# Altium schematic sheet stm32f107rct7_devbrd.SchDoc
size A4
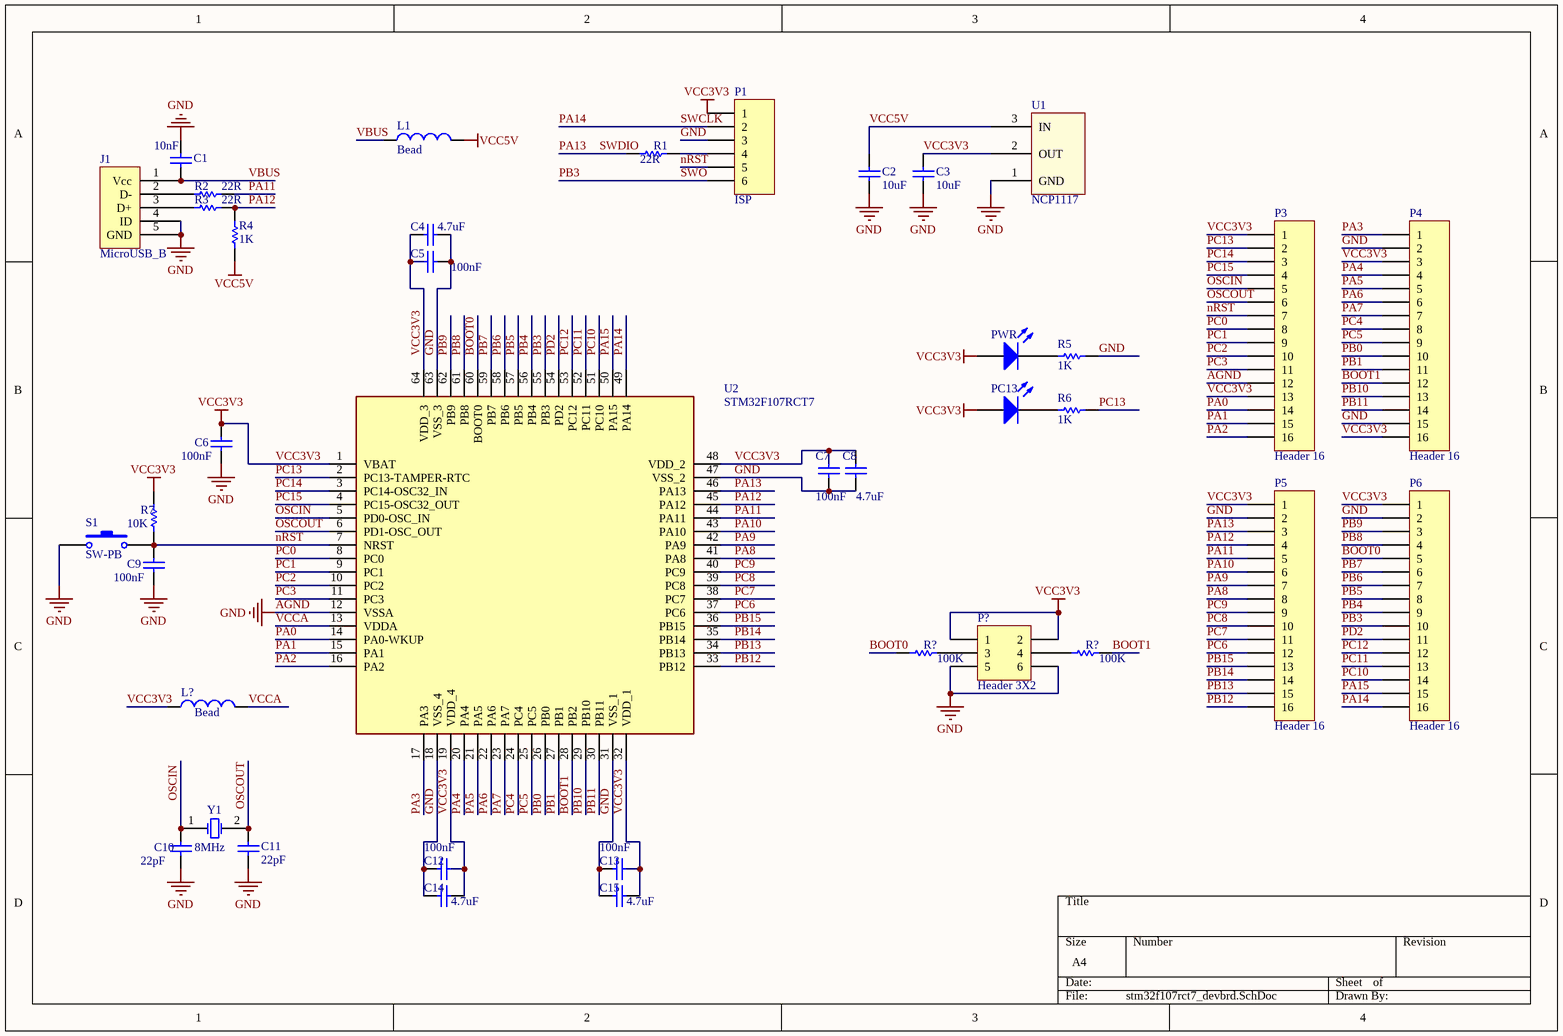
[diagram p0: stm32f107rct7_devbrd.SchDoc]

## Parts
(Parts that share a designator on the sheet are numbered #1, #2 ... from top to bottom, then left to right.)
C1  value 10nF  [SMD0805_CAP]  (hidden comment: Cap Semi)
C2  value 10uF  [SMD0805_CAP]  (hidden comment: Cap Semi)
C3  value 10uF  [SMD0805_CAP]  (hidden comment: Cap Semi)
C4  value 4.7uF  [SMD0805_CAP]  (hidden comment: Cap Semi)
C5  value 100nF  [SMD0805_CAP]  (hidden comment: Cap Semi)
C6  value 100nF  [SMD0805_CAP]  (hidden comment: Cap Semi)
C7  value 100nF  [SMD0805_CAP]  (hidden comment: Cap Semi)
C8  value 4.7uF  [SMD0805_CAP]  (hidden comment: Cap Semi)
C9  value 100nF  [SMD0805_CAP]  (hidden comment: Cap Semi)
C10  value 22pF  [SMD0805_CAP]  (hidden comment: Cap Semi)
C11  value 22pF  [SMD0805_CAP]  (hidden comment: Cap Semi)
C12  value 100nF  [SMD0805_CAP]  (hidden comment: Cap Semi)
C13  value 100nF  [SMD0805_CAP]  (hidden comment: Cap Semi)
C14  value 4.7uF  [SMD0805_CAP]  (hidden comment: Cap Semi)
C15  value 4.7uF  [SMD0805_CAP]  (hidden comment: Cap Semi)
J1  MicroUSB_B  [micro_usb_molex_105017-0001]
L1  Bead  [SMD0805]
L?  Bead  [SMD0805]
P1  ISP  [ISP]
P3  Header 16  [HDR1X16]
P4  Header 16  [HDR1X16]
P5  Header 16  [HDR1X16]
P6  Header 16  [HDR1X16]
P?  Header 3X2  [HDR2X3]
PC13  LED0  [LED]  (value not drawn)
PWR  LED0  [LED]  (value not drawn)
R1  value 22R  [SMD0805]  (hidden comment: Res Semi)
R2  value 22R  [SMD0805]  (hidden comment: Res Semi)
R3  value 22R  [SMD0805]  (hidden comment: Res Semi)
R4  value 1K  [SMD0805]  (hidden comment: Res Semi)
R5  value 1K  [SMD0805]  (hidden comment: Res Semi)
R6  value 1K  [SMD0805]  (hidden comment: Res Semi)
R7  value 10K  [SMD0805]  (hidden comment: Res Semi)
R?#1  value 100K  [SMD0805]  (hidden comment: Res Semi)
R?#2  value 100K  [SMD0805]  (hidden comment: Res Semi)
S1  SW-PB  [button_small]
U1  NCP1117  [SOT-223-2]
U2  STM32F107RCT7  [QFP50P1200X1200X160-64N]
Y1  8MHz  [XTAL]

## Nets
AGND: C1.2 C2.1 C3.1 C4.1 C5.1 C6.1 C7.1 C8.1 C9.1 C10.2 C11.2 C12.1 C13.1 C14.1 C15.1 J1.4(ID) J1.5(GND) P1.3 P3.12 P4.2 P4.15 P5.2 P6.2 P?.5 P?.6 R5.1 S1.1 U1.1(GND) U2.12(VSSA) U2.18(VSS_4) U2.31(VSS_1) U2.47(VSS_2) U2.63(VSS_3)  [also labelled GND]
VCC3V3: C3.2 C4.2 C5.2 C6.2 C7.2 C8.2 C12.2 C13.2 C14.2 C15.2 L?.1 P1.1 P3.1 P3.13 P4.3 P4.16 P5.1 P6.1 P?.1 P?.2 PC13.1(A) PWR.1(A) R7.2 U1.2(OUT) U2.1(VBAT) U2.19(VDD_4) U2.32(VDD_1) U2.48(VDD_2) U2.64(VDD_3)
VCC5V: C2.2 L1.2 R4.1 U1.3(IN)
BOOT0: P6.5 R?#1.1 U2.60(BOOT0)
BOOT1: P4.12 R?#2.2 U2.28(PB2)
nRST: C9.2 P1.5 P3.7 R7.1 S1.2 U2.7(NRST)
OSCIN: C10.1 P3.5 U2.5(PD0-OSC_IN) Y1.1(OSC1)
OSCOUT: C11.1 P3.6 U2.6(PD1-OSC_OUT) Y1.2(OSC2)
PA0: P3.14 U2.14(PA0-WKUP)
PA1: P3.15 U2.15(PA1)
PA2: P3.16 U2.16(PA2)
PA3: P4.1 U2.17(PA3)
PA4: P4.4 U2.20(PA4)
PA5: P4.5 U2.21(PA5)
PA6: P4.6 U2.22(PA6)
PA7: P4.7 U2.23(PA7)
PA8: P5.8 U2.41(PA8)
PA9: P5.7 U2.42(PA9)
PA10: P5.6 U2.43(PA10)
PA11: P5.5 R2.2 U2.44(PA11)
PA12: P5.4 R3.2 R4.2 U2.45(PA12)
PA13: P5.3 R1.1 U2.46(PA13)  [also labelled SWDIO]
PA14: P1.2 P6.16 U2.49(PA14)  [also labelled SWCLK]
PA15: P6.15 U2.50(PA15)
PB0: P4.10 U2.26(PB0)
PB1: P4.11 U2.27(PB1)
PB3: P1.6 P6.10 U2.55(PB3)  [also labelled SWO]
PB4: P6.9 U2.56(PB4)
PB5: P6.8 U2.57(PB5)
PB6: P6.7 U2.58(PB6)
PB7: P6.6 U2.59(PB7)
PB8: P6.4 U2.61(PB8)
PB9: P6.3 U2.62(PB9)
PB10: P4.13 U2.29(PB10)
PB11: P4.14 U2.30(PB11)
PB12: P5.16 U2.33(PB12)
PB13: P5.15 U2.34(PB13)
PB14: P5.14 U2.35(PB14)
PB15: P5.13 U2.36(PB15)
PC0: P3.8 U2.8(PC0)
PC1: P3.9 U2.9(PC1)
PC2: P3.10 U2.10(PC2)
PC3: P3.11 U2.11(PC3)
PC4: P4.8 U2.24(PC4)
PC5: P4.9 U2.25(PC5)
PC6: P5.12 U2.37(PC6)
PC7: P5.11 U2.38(PC7)
PC8: P5.10 U2.39(PC8)
PC9: P5.9 U2.40(PC9)
PC10: P6.14 U2.51(PC10)
PC11: P6.13 U2.52(PC11)
PC12: P6.12 U2.53(PC12)
PC13: P3.2 R6.1 U2.2(PC13-TAMPER-RTC)
PC14: P3.3 U2.3(PC14-OSC32_IN)
PC15: P3.4 U2.4(PC15-OSC32_OUT)
PD2: P6.11 U2.54(PD2)
VBUS: C1.1 J1.1(Vcc) L1.1
VCCA: L?.2 U2.13(VDDA)
NetJ1_2: J1.2(D-) R2.1
NetJ1_3: J1.3(D+) R3.1
NetP1_4: P1.4 R1.2
NetP?_3: P?.3 R?#1.2
NetP?_4: P?.4 R?#2.1
NetPC13_2: PC13.2(K) R6.2
NetPWR_2: PWR.2(K) R5.2

## Library data of the parts
C1-C15 = Cap Semi: Capacitor (Semiconductor SIM Model); Published: 8-Jun-2000; LatestRevisionDate: 29-May-2009; LatestRevisionNote: IPC-7351 Footprint Added.; PackageReference: C1206; Publisher: Altium Limited; PackageDescription: Chip Capacitor
L1 = Inductor: Code_IEC: 1005; Published: 8-Jun-2000; LatestRevisionDate: 29-May-2009; LatestRevisionNote: IPC-7351 Footprint Added.; PackageReference: 0402-A; Publisher: Altium Limited; PackageDescription: Chip Inductor; Code_JEITA: 0402; Value: Bead
L? = Inductor: Code_IEC: 1005; Value: 10mH; Published: 8-Jun-2000; LatestRevisionDate: 29-May-2009; LatestRevisionNote: IPC-7351 Footprint Added.; PackageReference: 0402-A; Publisher: Altium Limited; PackageDescription: Chip Inductor; Code_JEITA: 0402
P1 = MHDR1X6: Header, 6-Pin; LatestRevisionDate: 17-Jul-2002; LatestRevisionNote: Re-released for DXP Platform.; Publisher: Altium Limited
P3-P6 = Header 16: Header, 16-Pin; LatestRevisionDate: 17-Jul-2002; LatestRevisionNote: Re-released for DXP Platform.; Publisher: Altium Limited
P? = Header 3X2: Header, 3-Pin, Dual row; LatestRevisionDate: 17-Jul-2002; LatestRevisionNote: Re-released for DXP Platform.; Publisher: Altium Limited
PC13 PWR = LED0: Typical INFRARED GaAs LED; Published: 8-Jun-2000; LatestRevisionDate: 08-Jul-2005; LatestRevisionNote: Mech Layer 1 removed.; PackageReference: LED-0; Publisher: Altium Limited; PackageDescription: LED; 2 Leads
R1-R7 R?#1 R?#2 = Res Semi: Semiconductor Resistor; Published: 8-Jun-2000; LatestRevisionDate: 17-Jul-2002; LatestRevisionNote: Re-released for DXP Platform.; PackageReference: AXIAL-0.5; Publisher: Altium Limited; PackageDescription: Axial Device, Thru-Hole; 2 Leads; 0.5 in Pin Spacing
S1 = SW-PB: Switch; Published: 24-Mar-1999; LatestRevisionDate: 17-Jul-2002; LatestRevisionNote: Re-released for DXP Platform.; PackageReference: SPST-2; Publisher: Altium Limited; PackageDescription: Switch; 2 Leads
U1 = NCP1117: IC REG 5V 1A DPAC
U2 = STM32F107RCT7: Integrated Circuit; Manufacturer_Name: STMicroelectronics; Datasheet Link: https://componentsearchengine.com//STM32F107RCT7.pdf; Height: 1.6mm; Mouser2 Part Number: 511-STM32F107RCT7; Mouser2 Price/Stock: https://www.mouser.com/Search/Refine.aspx?Keyword=511-STM32F107RCT7; Manufacturer_Part_Number: STM32F107RCT7
Y1 = XTAL: Crystal Oscillator; Published: 8-Jun-2000; LatestRevisionDate: 17-Jul-2002; LatestRevisionNote: Re-released for DXP Platform.; PackageReference: R38; Publisher: Altium Limited; PackageDescription: Crystal, Thru-Hole; 2 Leads; Body 3.1 x 8.2 mm (Dia.xH)